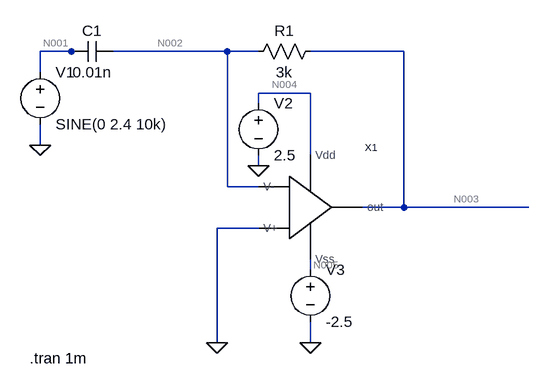
[diagram p0: schematic 3a.asc]
3a.asc, the LTspice schematic file:
Version 4
SHEET 1 880 680
WIRE -192 -160 -240 -160
WIRE -176 -160 -192 -160
WIRE 48 -160 -128 -160
WIRE 96 -160 48 -160
WIRE 320 -160 176 -160
WIRE -240 -128 -240 -160
WIRE 176 -96 96 -96
WIRE 96 -80 96 -96
WIRE -240 -16 -240 -48
WIRE 176 0 176 -96
WIRE 96 16 96 0
WIRE 48 48 48 -160
WIRE 96 48 48 48
WIRE 320 80 320 -160
WIRE 320 80 256 80
WIRE 512 80 320 80
WIRE 96 112 32 112
WIRE 176 176 176 160
WIRE 32 288 32 112
WIRE 176 288 176 256
FLAG 32 288 0
FLAG 176 288 0
FLAG 96 16 0
FLAG -240 -16 0
SYMBOL res 192 -176 R90
WINDOW 0 0 56 VBottom 2
WINDOW 3 32 56 VTop 2
SYMATTR InstName R1
SYMATTR Value 3k
SYMBOL voltage -240 -144 R0
WINDOW 123 0 0 Left 0
WINDOW 39 0 0 Left 0
SYMATTR InstName V1
SYMATTR Value SINE(0 2.4 10k)
SYMBOL voltage 96 -96 R0
WINDOW 123 0 0 Left 0
WINDOW 39 0 0 Left 0
SYMATTR InstName V2
SYMATTR Value 2.5
SYMBOL voltage 176 160 R0
WINDOW 123 0 0 Left 0
WINDOW 39 0 0 Left 0
SYMATTR InstName V3
SYMATTR Value -2.5
SYMBOL OPAMP 64 80 R0
SYMATTR InstName X1
SYMBOL cap -128 -176 R90
WINDOW 0 0 32 VBottom 2
WINDOW 3 32 32 VTop 2
SYMATTR InstName C1
SYMATTR Value 0.01n
TEXT -256 312 Left 2 !.tran 1m

The netlist it stands for:
* 3a.asc
R1 N003 N002 3k
V1 N001 0 SINE(0 2.4 10k)
V2 N004 0 2.5
V3 N005 0 -2.5
XX1 N004 N005 N002 0 N003 OPAMP  ; pins Vdd Vss V- V+ out
C1 N002 N001 0.01n
.tran 1m
.backanno
.end

* Results of the author's LTspice run, read from the files saved beside the schematic
* Operating Point, zero values left out:
*   V(n003) = 47.95 µV
*   V(n002) = 47.95 µV
*   V(n004) = 2.5 V
*   V(n005) = -2.5 V
*   I(V2) = -188.4 µA
*   I(V3) = 188.4 µA
*   Ix(x1:VDD) = 188.4 µA
*   Ix(x1:VSS) = -188.4 µA
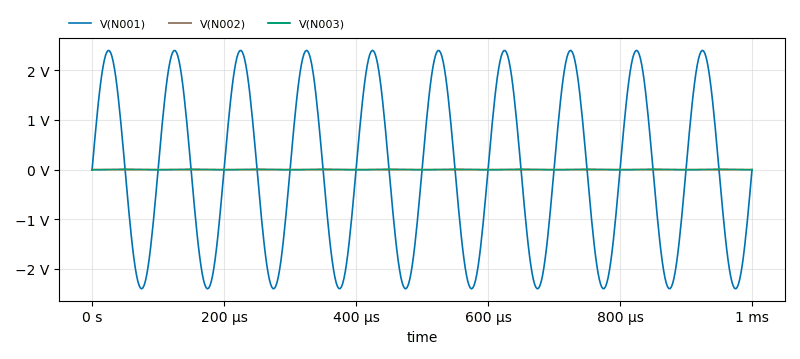
[diagram p1: Transient Analysis of 3a.asc, plotted from the saved traces]
* Transient Analysis, 1 run:
*   V(N001): min -2.4 V, max 2.4 V, average -4.378 µV, rms 1.697 V, last 0 V
*   V(N002): min -1.138 mV, max 2.934 mV, average 48.11 µV, rms 54.3 µV, last 58.82 µV
*   V(N003): min -6.18 mV, max 4.557 mV, average 48.12 µV, rms 3.189 mV, last -4.464 mV